# Altium schematic sheet Analog.SchDoc
size A3; Author: HamidFijani; DrawnBy: HamidFijani; SheetNumber: 11; SheetTotal: 13
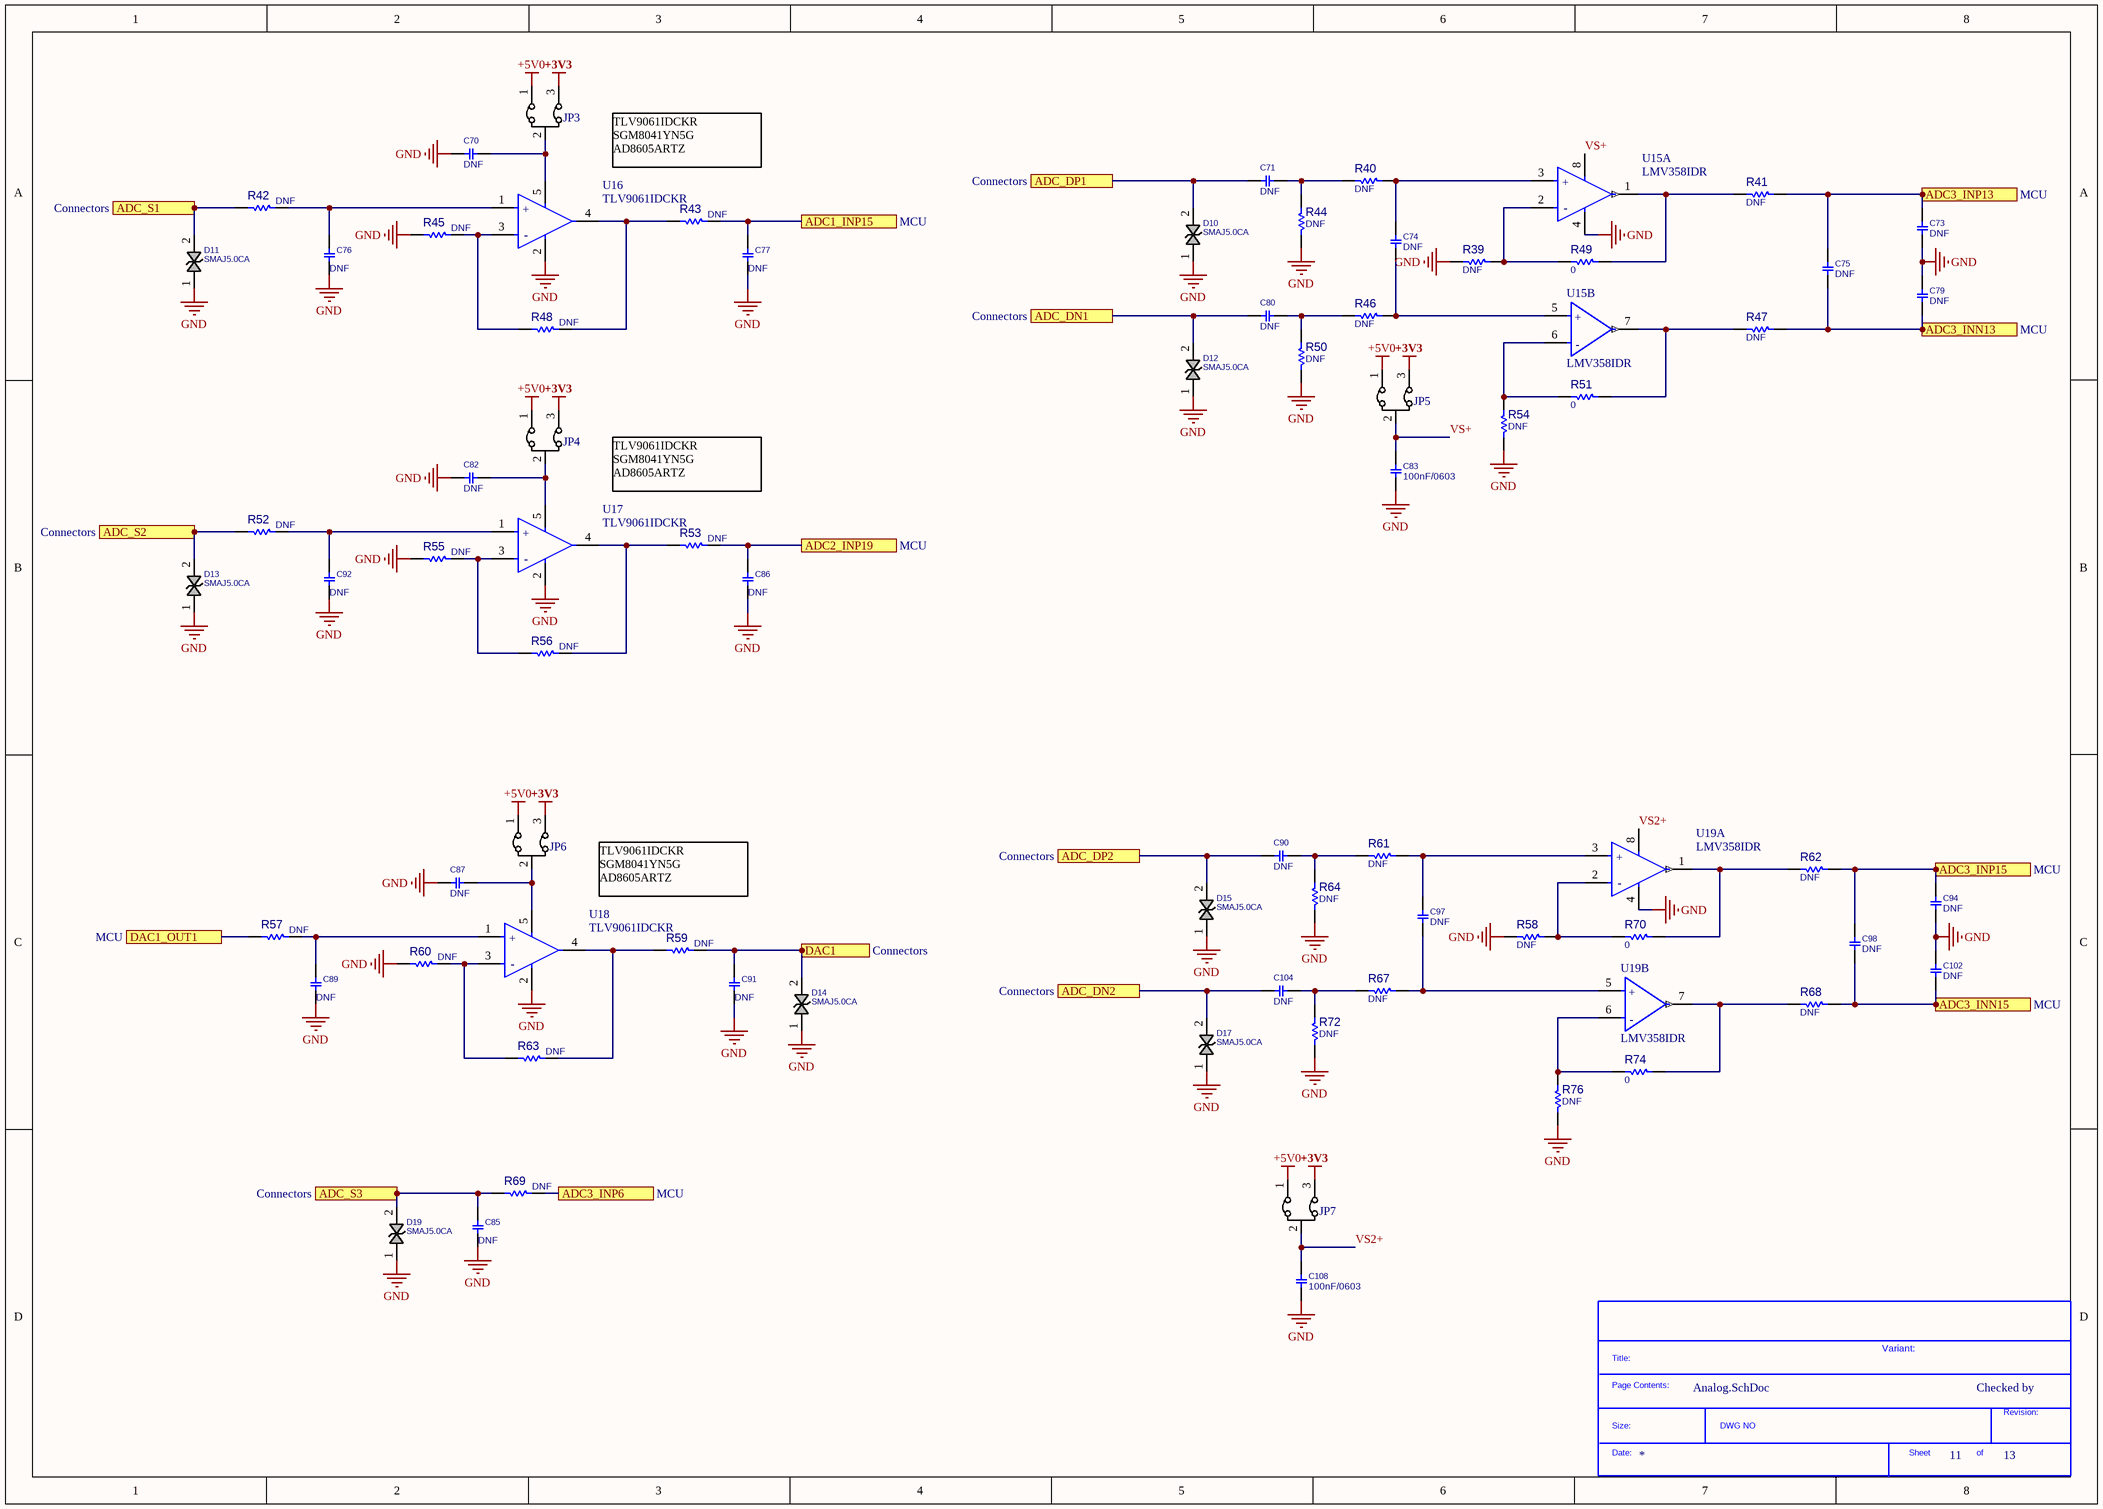
[diagram p0: Analog.SchDoc]

## Parts
?  (no value)  (graphical)
C70  DNF  [C0603]
C71  DNF  [C0603]
C73  DNF  [C0603]
C74  DNF  [C0603]
C75  DNF  [C0603]
C76  DNF  [C0603]
C77  DNF  [C0603]
C79  DNF  [C0603]
C80  DNF  [C0603]
C82  DNF  [C0603]
C83  100nF/0603  [C0603]
C85  DNF  [C0603]
C86  DNF  [C0603]
C87  DNF  [C0603]
C89  DNF  [C0603]
C90  DNF  [C0603]
C91  DNF  [C0603]
C92  DNF  [C0603]
C94  DNF  [C0603]
C97  DNF  [C0603]
C98  DNF  [C0603]
C102  DNF  [C0603]
C104  DNF  [C0603]
C108  100nF/0603  [C0603]
D10  SMAJ5.0CA  [D_SMA]
D11  SMAJ5.0CA  [D_SMA]
D12  SMAJ5.0CA  [D_SMA]
D13  SMAJ5.0CA  [D_SMA]
D14  SMAJ5.0CA  [D_SMA]
D15  SMAJ5.0CA  [D_SMA]
D17  SMAJ5.0CA  [D_SMA]
D19  SMAJ5.0CA  [D_SMA]
JP3  JMPHDR3PIN  [JP_3_40X90]  (value not drawn)  (no BOM)
JP4  JMPHDR3PIN  [JP_3_40X90]  (value not drawn)  (no BOM)
JP5  JMPHDR3PIN  [JP_3_40X90]  (value not drawn)  (no BOM)
JP6  JMPHDR3PIN  [JP_3_40X90]  (value not drawn)  (no BOM)
JP7  JMPHDR3PIN  [JP_3_40X90]  (value not drawn)  (no BOM)
R39  DNF  [R0603]
R40  DNF  [R0603]
R41  DNF  [R0603]
R42  DNF  [R0603]
R43  DNF  [R0603]
R44  DNF  [R0603]
R45  DNF  [R0603]
R46  DNF  [R0603]
R47  DNF  [R0603]
R48  DNF  [R0603]
R49  0  [R0603]
R50  DNF  [R0603]
R51  0  [R0603]
R52  DNF  [R0603]
R53  DNF  [R0603]
R54  DNF  [R0603]
R55  DNF  [R0603]
R56  DNF  [R0603]
R57  DNF  [R0603]
R58  DNF  [R0603]
R59  DNF  [R0603]
R60  DNF  [R0603]
R61  DNF  [R0603]
R62  DNF  [R0603]
R63  DNF  [R0603]
R64  DNF  [R0603]
R67  DNF  [R0603]
R68  DNF  [R0603]
R69  DNF  [R0603]
R70  0  [R0603]
R72  DNF  [R0603]
R74  0  [R0603]
R76  DNF  [R0603]
U15  LMV358IDR  [FP-D0008A-MFG]  (parts A,B of 2)
U16  TLV9061IDCKR  [FP-DCK0005A-MFG]
U17  TLV9061IDCKR  [FP-DCK0005A-MFG]
U18  TLV9061IDCKR  [FP-DCK0005A-MFG]
U19  LMV358IDR  [FP-D0008A-MFG]  (parts A,B of 2)

## Ports
ADC1_INP15 (see MCU), ADC2_INP19 (see MCU), ADC3_INN13 (see MCU), ADC3_INN15 (see MCU), ADC3_INP6 (see MCU), ADC3_INP13 (see MCU), ADC3_INP15 (see MCU), ADC_DN1 (see Connectors), ADC_DN2 (see Connectors), ADC_DP1 (see Connectors), ADC_DP2 (see Connectors), ADC_S1 (see Connectors), ADC_S2 (see Connectors), ADC_S3 (see Connectors), DAC1 (see Connectors), DAC1_OUT1 (see MCU)

## Nets
+3V3: JP3.3 JP4.3 JP5.3 JP6.3 JP7.3
+5V0: JP3.1 JP4.1 JP5.1 JP6.1 JP7.1
GND: C70.2 C73.2 C76.2 C77.2 C79.1 C82.2 C83.2 C85.2 C86.2 C87.2 C89.2 C91.2 C92.2 C94.2 C102.1 C108.2 D10.1 D11.1 D12.1 D13.1 D14.1 D15.1 D17.1 D19.1 R39.2 R44.1 R45.1 R50.1 R54.2 R55.1 R58.2 R60.1 R64.1 R72.1 R76.2 U15.4(GND) U16.2(V-) U17.2(V-) U18.2(V-) U19.4(GND)
ADC1_INP15: C77.1 R43.2 ; port ADC1_INP15
ADC2_INP19: C86.1 R53.2 ; port ADC2_INP19
ADC3_INN13: C75.2 C79.2 R47.2 ; port ADC3_INN13
ADC3_INN15: C98.2 C102.2 R68.2 ; port ADC3_INN15
ADC3_INP6: R69.2 ; port ADC3_INP6
ADC3_INP13: C73.1 C75.1 R41.2 ; port ADC3_INP13
ADC3_INP15: C94.1 C98.1 R62.2 ; port ADC3_INP15
ADC_DN1: C80.1 D12.2 ; port ADC_DN1
ADC_DN2: C104.1 D17.2 ; port ADC_DN2
ADC_DP1: C71.1 D10.2 ; port ADC_DP1
ADC_DP2: C90.1 D15.2 ; port ADC_DP2
ADC_S1: D11.2 R42.1 ; port ADC_S1
ADC_S2: D13.2 R52.1 ; port ADC_S2
ADC_S3: C85.1 D19.2 R69.1 ; port ADC_S3
DAC1: C91.1 D14.2 R59.2 ; port DAC1
DAC1_OUT1: R57.1 ; port DAC1_OUT1
VS2+: C108.1 JP7.2 U19.8(VCC+)
VS+: C83.1 JP5.2 U15.8(VCC+)
NetC70_1: C70.1 JP3.2 U16.5(V+)
NetC71_2: C71.2 R40.1 R44.2
NetC74_1: C74.1 R40.2 U15.3(1IN+)
NetC74_2: C74.2 R46.2 U15.5(2IN+)
NetC76_1: C76.1 R42.2 U16.1(IN+)
NetC80_2: C80.2 R46.1 R50.2
NetC82_1: C82.1 JP4.2 U17.5(V+)
NetC87_1: C87.1 JP6.2 U18.5(V+)
NetC89_1: C89.1 R57.2 U18.1(IN+)
NetC90_2: C90.2 R61.1 R64.2
NetC92_1: C92.1 R52.2 U17.1(IN+)
NetC97_1: C97.1 R61.2 U19.3(1IN+)
NetC97_2: C97.2 R67.2 U19.5(2IN+)
NetC104_2: C104.2 R67.1 R72.2
NetR39_1: R39.1 R49.2 U15.2(1IN-)
NetR41_1: R41.1 R49.1 U15.1(OUT)
NetR43_1: R43.1 R48.2 U16.4(OUT)
NetR45_2: R45.2 R48.1 U16.3(IN-)
NetR47_1: R47.1 R51.1 U15.7(2OUT)
NetR51_2: R51.2 R54.1 U15.6(2IN-)
NetR53_1: R53.1 R56.2 U17.4(OUT)
NetR55_2: R55.2 R56.1 U17.3(IN-)
NetR58_1: R58.1 R70.2 U19.2(1IN-)
NetR59_1: R59.1 R63.2 U18.4(OUT)
NetR60_2: R60.2 R63.1 U18.3(IN-)
NetR62_1: R62.1 R70.1 U19.1(OUT)
NetR68_1: R68.1 R74.1 U19.7(2OUT)
NetR74_2: R74.2 R76.1 U19.6(2IN-)

## Notes on the sheet
- TLV9061IDCKR
  SGM8041YN5G
  AD8605ARTZ
- Title:
- Page Contents:
- Variant:
- Checked by
- Size:
- Date:
- DWG NO
- Sheet
- of
- Revision:
- (in symbol CMP-04895-000108-1) +; -
- (in symbol CMP-04895-000136-1, part A) +; -
- (in symbol CMP-04895-000136-1, part B) +; -

## Library data of the parts
? = SDTitleBlock
C70 C71 C73-C77 C79 C80 C82 C83 C85-C87 C89-C92 C94 C97 C98 C102 C104 C108 = CAP_SMD_MLCC_0603: CAP, MLCC; PARAM: -, -%; MANF_P#: MANF_PART#; PARAM2: -V; PRICE: 100= 1$; MANF: -; ASSEMBLY: ASSEMBLY
  C70 C71 C73-C77 C79 C80 C82 C85-C87 C89-C92 C94 C97 C98 C102 C104: VALUE: DNF
  C83 C108: VALUE: 100nF/0603
D10-D15 D17 D19 = TVS_SMAJ5CA: TVS, ESD PROTECT, Bidirectional; MANF: Littelfuse; PARAM2: 5VR, 6.74VBR; PARAM: -65~150°C; MANF_P#: SMAJ5CA; PRICE: 0.5t@Paya; VALUE: SMAJ5.0CA
JP3-JP7 = JUMPER_SOLDER_3P: JUMPER, HEADER 3PIN; MANF: MANF; MANF_P#: MANF_P#; VALUE: JMPHDR3PIN
R39-R64 R67-R70 R72 R74 R76 = RES_SMD_0603: RESISTOR, SMD; PARAM: 1%, 0.1W; DESC: DESCRIPTION; DIST#: MOUSER; MANF_P#: -; MANF: -; ASSEMBLY: ASSEMBLY; PRICE: -; PARAM2: -
  R39-R48 R50 R52-R64 R67-R69 R72 R76: VALUE: DNF
  R49 R51 R70 R74: VALUE: 0
U15 U19 = CMP-04895-000136-1: IC OPAMP GP 2 CIRCUIT 8SOIC; Number of Elements: 2; Min Supply Voltage: 2.7V; Input Bias Current: 250nA; Output Current per Channel: 160mA; Bandwidth: 1MHz; Voltage Gain: 100dB; Input Offset Voltage (Vos): 7mV; Slew Rate: 1V/µs; Nominal Supply Current: 440uA; Power Supply Rejection Ratio (PSRR): 50dB; Max Supply Voltage: 5.5V; Operating Supply Current: 210uA; Lead Free: Lead Free; Length: 4.9mm; RoHS Compliant: Yes; REACH SVHC: No SVHC; Case/Package: SOIC; Height: 1.58mm; Number of Channels: 2; Number of Amplifiers: 2; Radiation Hardening: No; Number of Circuits: 2; Mount: Surface Mount; Contact Plating: Gold; Unity Gain Bandwidth Product: 1MHz; Min Operating Temperature: -40°C; Max Operating Temperature: 125°C; Width: 3.91mm; Gain Bandwidth Product: 1MHz; Number of Pins: 8; Packaging: Tape and Reel; Package Quantity: 2500; Output Current: 160mA; Common Mode Rejection Ratio: 50dB
U16-U18 = CMP-04895-000108-1: IC CMOS 1 CIRCUIT SC70-5; RoHS Compliant: Yes